# Altium schematic sheet PWR_MGMT.SchDoc
size A4; SheetNumber: 4; SheetTotal: 5
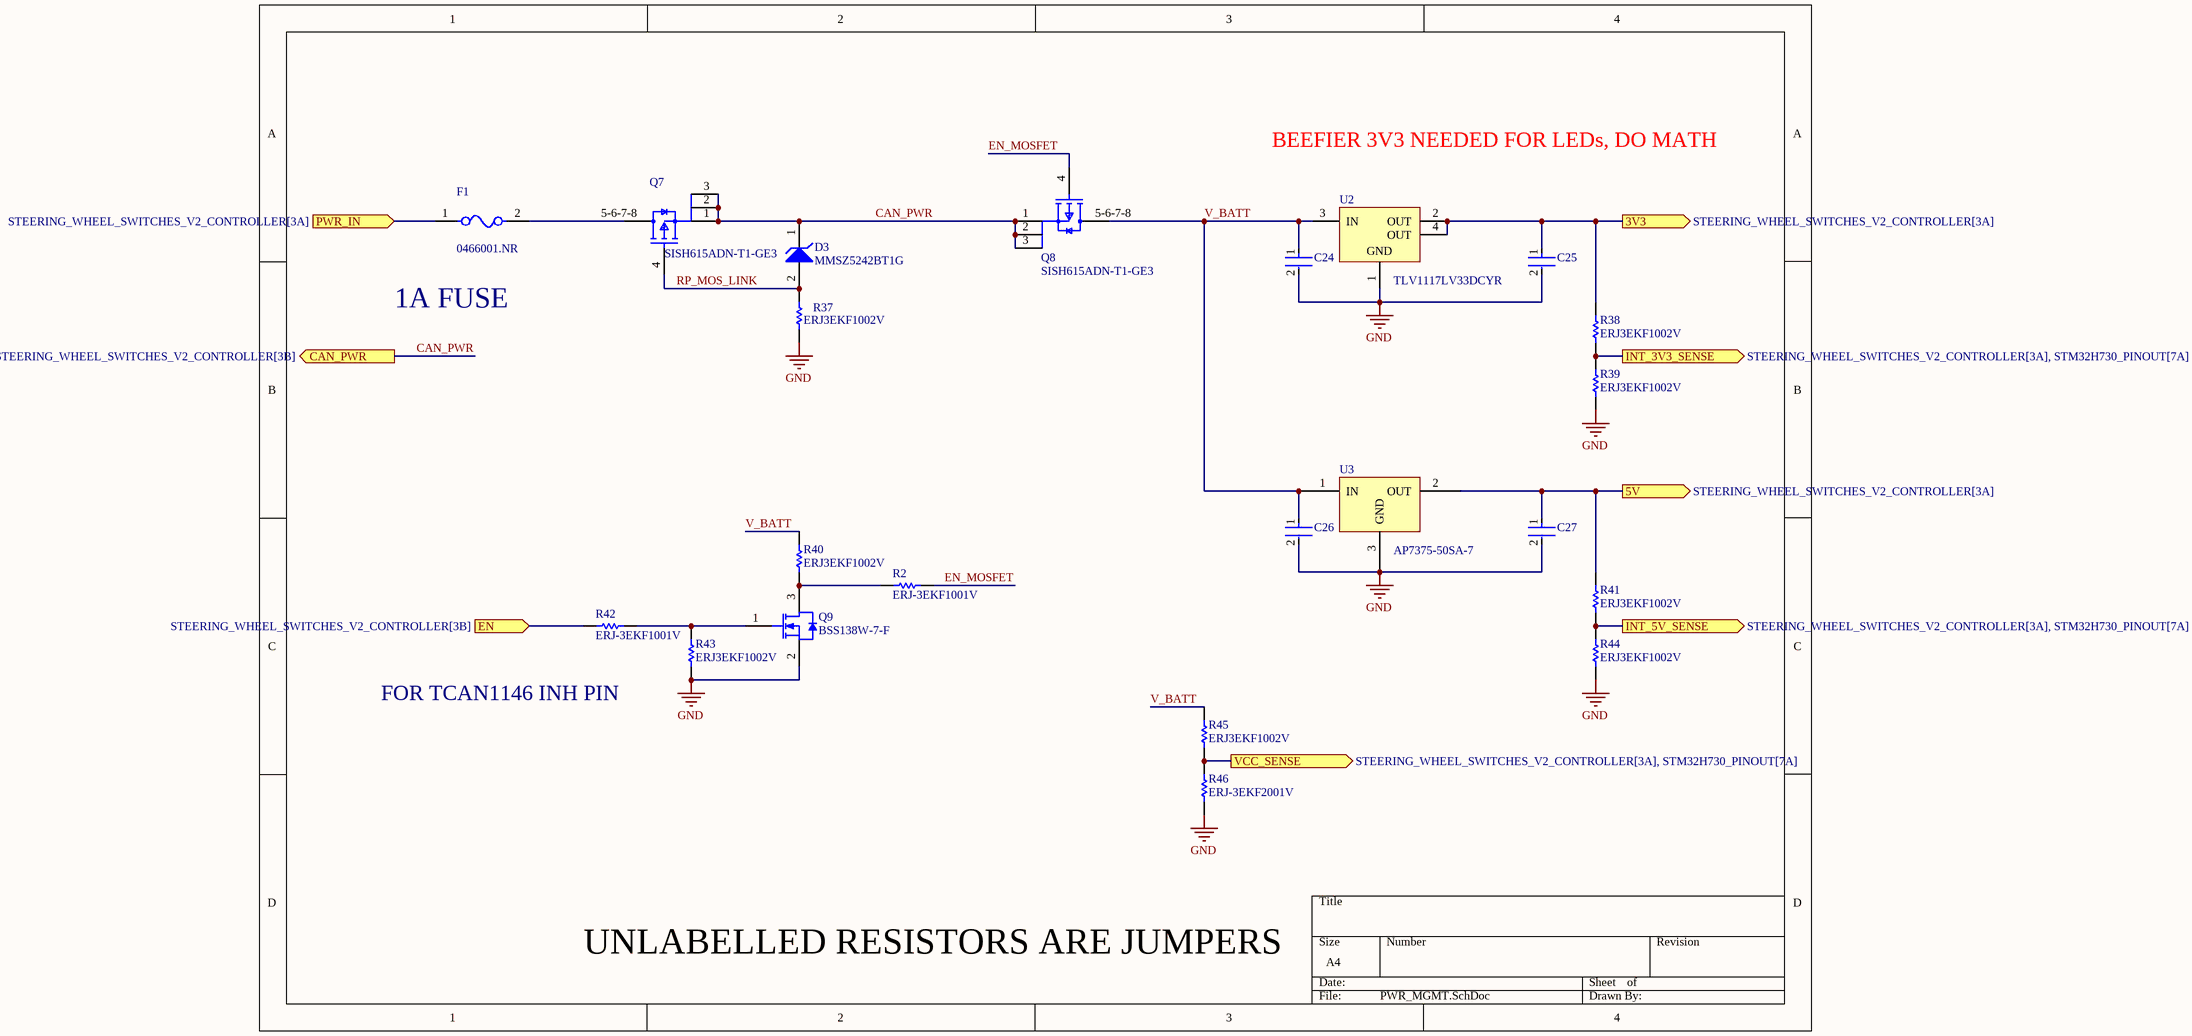
[diagram p0: PWR_MGMT.SchDoc]

## Parts
C24  GRM188R61E106KA73D  [FP-GRM188-0_2-IPC_A]  (value not drawn)
C25  GRM188R61E106KA73D  [FP-GRM188-0_2-IPC_A]  (value not drawn)
C26  GRM188R61E106KA73D  [FP-GRM188-0_2-IPC_A]  (value not drawn)
C27  GRM188R61E106KA73D  [FP-GRM188-0_2-IPC_A]  (value not drawn)
D3  MMSZ5242BT1G  [ONSC-SOD-123-2-425-04_V]
F1  0466001.NR  [FP-0466-MFG]
Q7  SISH615ADN-T1-GE3  [SISH615ADN-T1-GE3-Footprint-1]
Q8  SISH615ADN-T1-GE3  [SISH615ADN-T1-GE3-Footprint-1]
Q9  BSS138W-7-F  [DIOD-SOT323-3_V]
R2  ERJ-3EKF1001V  [RESC1608X55X30LL15T15]
R37  ERJ3EKF1002V  [RESC1609X55X30LL15T15]
R38  ERJ3EKF1002V  [RESC1609X55X30LL15T15]
R39  ERJ3EKF1002V  [RESC1609X55X30LL15T15]
R40  ERJ3EKF1002V  [RESC1609X55X30LL15T15]
R41  ERJ3EKF1002V  [RESC1609X55X30LL15T15]
R42  ERJ-3EKF1001V  [RESC1608X55X30LL15T15]
R43  ERJ3EKF1002V  [RESC1609X55X30LL15T15]
R44  ERJ3EKF1002V  [RESC1609X55X30LL15T15]
R45  ERJ3EKF1002V  [RESC1609X55X30LL15T15]
R46  ERJ-3EKF2001V  [RESC1608X55X30ML15T15]
U2  TLV1117LV33DCYR  [DCY0004A_N]
U3  AP7375-50SA-7  [AP7375-50SA-7-Footprint-1]

## Ports
3V3 (out, see STEERING_WHEEL_SWITCHES_V2_CONTROLLER[3A]), 5V (out, see STEERING_WHEEL_SWITCHES_V2_CONTROLLER[3A]), CAN_PWR (out, see STEERING_WHEEL_SWITCHES_V2_CONTROLLER[3B]), EN (in, see STEERING_WHEEL_SWITCHES_V2_CONTROLLER[3B]), INT_3V3_SENSE (out, see STEERING_WHEEL_SWITCHES_V2_CONTROLLER[3A], STM32H730_PINOUT[7A]), INT_5V_SENSE (out, see STEERING_WHEEL_SWITCHES_V2_CONTROLLER[3A], STM32H730_PINOUT[7A]), PWR_IN (in, see STEERING_WHEEL_SWITCHES_V2_CONTROLLER[3A]), VCC_SENSE (out, see STEERING_WHEEL_SWITCHES_V2_CONTROLLER[3A], STM32H730_PINOUT[7A])

## Nets
GND: C24.2 C25.2 C26.2 C27.2 Q9.2(S) R37.2 R39.1 R43.1 R44.2 R46.1 U2.1(GND) U3.3(GND)
3V3: C25.1 R38.2 U2.2(OUT) U2.4(OUT) ; port 3V3
5V: C27.1 R41.2 U3.2(OUT) ; port 5V
CAN_PWR: D3.1(K) Q7.1(S) Q7.2(S) Q7.3(S) Q8.1(S) Q8.2(S) Q8.3(S) ; port CAN_PWR
EN: R42.2 ; port EN
EN_MOSFET: Q8.4(G) R2.1
INT_3V3_SENSE: R38.1 R39.2 ; port INT_3V3_SENSE
INT_5V_SENSE: R41.1 R44.1 ; port INT_5V_SENSE
PWR_IN: F1.1 ; port PWR_IN
RP_MOS_LINK: D3.2(A) Q7.4(G) R37.1
V_BATT: C24.1 C26.1 Q8.5-6-7-8(D) R40.2 R45.2 U2.3(IN) U3.1(IN)
VCC_SENSE: R45.1 R46.2 ; port VCC_SENSE
NetF1_2: F1.2 Q7.5-6-7-8(D)
NetQ9_1: Q9.1(G) R42.1 R43.2
NetQ9_3: Q9.3(D) R2.2 R40.1

## Notes on the sheet
- BEEFIER 3V3 NEEDED FOR LEDs, DO MATH
- 1A FUSE
- FOR TCAN1146 INH PIN
- UNLABELLED RESISTORS ARE JUMPERS

## Library data of the parts
C24-C27 = CMP-06035-045268-1: Chip Multilayer Ceramic Capacitors for General Purpose, 0603, 10uF, X5R, 15%, 10%, 25V; Case/Package: 0603
D3 = CMP-1060-00565-1: Zener Voltage Regulator, 500 mW, 2-Pin SOD-123, Pb-Free, Tape and Reel; Manufacturer: On Semiconductor; P Max (W): 0.5; VZ Typ (V): 12; PartNumber: MMSZ5242BT1G; PackageReference: SOD-123-2-425-04; ComponentLink3URL: http://www.onsemi.com/pub_link/Collateral/425-04.PDF; Mounting Technology: Surface Mount; ComponentLink2Description: Datasheet; ComponentLink1URL: http://www.onsemi.com/; ComponentLink3Description: Package Specification; PackageDescription: 2-Pin SOD, Body 1.6 x 2.69 mm; PackageVersion: Rev. G, 10/2009; ComponentLink1Description: Manufacturer URL; RoHS: Pb-Free; ComponentLink2URL: http://www.onsemi.com/pub_link/Collateral/MMSZ5221BT1-D.PDF; Packing: Tape and Reel; DatasheetVersion: Rev. 12
F1 = CMP-08605-000058-1: FUSE BOARD MNT 1A 63VAC/VDC 1206; Manufacturer: Littelfuse Inc; Max Fuse Dc Voltage: 63V; Fuse Interrupt Ac Current: 50A; Fuse Voltage Drop: 79.97mV; Resistance: 0.075Ω; Value: 0.075Ω; Fuse I2T: 0.0423A2Sec; Fuse Blow Speed: Fast; Temperature Range High: +90°C; Max Fuse Ac Voltage: 63V; Manufacturer Part Number: 0466001.NR; Package: 0466; ComponentLink2URL: https://www.littelfuse.com/~/media/electronics/datasheets/fuses/littelfuse_fuse_466_datasheet.pdf.pdf; Device Class L3: unset; Lead Free: Yes; Automotive: No; Digikey Description: FUSE BOARD MNT 1A 63VAC/VDC 1206; Height: 0.66mm; Temperature Range Low: -55°C; Category: Fuse; ComponentLink2Description: Datasheet; Device Class L1: Circuit Protection; Device Class L2: Fuses; Fuse Current: 1A; Mouser Description: Surface Mount Fuses 63V FA 1206 1A VFA Slimline; Octopart: https://octopart.com/0466001.nr-littelfuse-566005; Fuse Interrupt Dc Current: 50A; RoHS: TRUE; Voltage Rating: 63V; Temperature: -55°C to +90°C
Q7 Q8 = CMP-013-00018-2: Trans MOSFET P-CH 20V 22.1A 8-Pin PowerPAK 1212 EP T/R; Source: SISH615ADN-T1-GE3.SchLib; Design Item ID: CMP-013-00036-4; Component Type: Standard; Pins: 5
Q9 = CMP-2000-05968-1: N-Channel Enhancement Mode Mosfet, 50 V, 200 mA, -55 to 150 degC, 6-Pin SOT-323, RoHS, Tape and Reel; Typical Turn-Off Delay Time: 20ns; Number of Channels: 1Channel; Type: EnhancementModeFieldEffectTransistor; Brand: DiodesIncorporated; Vds - Drain-Source Breakdown Voltage: 75V; Vgs - Gate-Source Voltage: 20V; Rds On - Drain-Source Resistance: 1.4Ohms; Transistor Type: 1N-Channel; Configuration: Single; Unit Weight: 0.000212oz; Pd - Power Dissipation: 200mW; Id - Continuous Drain Current: 200mA; Forward Transconductance - Min: 0.1S; Manufacturer URL: http://www.diodes.com/; Series: BSS138; Package Description: 3-Pin Small Outline Transistor, Body 2 x 1.25 mm, Pitch 0.65 mm; Mounting Technology: SurfaceMount; Product Category: MOSFET; RoHS: True; Maximum Operating Temperature: +150C; Height: 1mm; Length: 2.2mm; Technology: Si; Width: 1.35mm; Datasheet URL: http://www.diodes.com/_files/datasheets/ds30206.pdf; Manufacturer: DiodesIncorporated; Package / Case: SOT-323-3; Typical Turn-On Delay Time: 20ns; Transistor Polarity: N-Channel; Factory Pack Quantity: 3000; Packaging: Reel; Product: MOSFETSmallSignal; Datasheet Version: Rev. 11-2, 09/2013; Package Reference: SOT323; Minimum Operating Temperature: -55C; Mounting Style: SMD/SMT; Channel Mode: Enhancement
R2 R42 = CMP-2000-00180-1: Manufacturer: Panasonic; Part Number: ERJ-3EKF1001V
R37-R41 R43-R45 = CMP-1012-00623-3: Chip Resistor, 10 KOhm, +/- 1%, 0.1 W, -55 to 155 degC, 0603 (1608 Metric), RoHS, Tape and Reel; Manufacturer: Panasonic; Voltage Rating: 75V; Case\/Package: 0603; Power Rating: 100mW; Resistance: 10KOhm; Temperature Coefficient: 100ppm\/degreesC; Number of Pins: 2; Package Reference: 603; Depth: 0.8mm; Mount: SurfaceMount; Package Description: 2-Pin Surface Mount Device, Body 1.6 x 0.85 mm; Datasheet Version: 02/2017; Length: 1.6mm; Lead Free: LeadFree; Height: 0.45mm; Number of Terminations: 2; Max Power Dissipation: 100mW; Min Operating Temperature: -55degC; Datasheet URL: https://industrial.panasonic.com/cdbs/www-data/pdf/RDA0000/AOA0000C304.pdf; Termination: SMD/SMT; Case Code (Metric): 1608; Case Code (Imperial): 0603; Tolerance: 1%; Max Operating Temperature: 155degC; RoHSCompliant: true; Voltage Rating (DC): 75V; Radiation Hardening: No; Packaging: TapeandReel; Composition: ThickFilm; Mounting Technology: SurfaceMount; Manufacturer URL: http://www.panasonic.com/; Width: 0.031inch; REACH SVHC: NoSVHC; Contact Plating: Tin; Military Standard: Not; Package Quantity: 1
R46 = CMP-2000-00317-1: Manufacturer: Panasonic; Part Number: ERJ-3EKF2001V
U2 = CMP-0395-00503-2: Single Output LDO, 1 A, Fixed 3.3 V Output, 2 to 5.5 V Input, 4-pin SOT-223 (DCY), -40 to 125 degC, Green (RoHS & no Sb/Br); Manufacturer: Texas Instruments; Vout Adj(Min)(V): 3.3; Vdo(Typ)(mV): 1200; Iq(Typ)(mA): 0.05; Accuracy(%): 2; Iout(Max)(A): 1; SubFamily: Single Channel LDO; Vin(Max)(V): 5.5; PackageReference: DCY0004A; PackageDescription: 4-Pin Plastic Small Outline, Body 3.5 x 6.5 mm, Pitch 2.3 mm; Vout Adj(Max)(V): 3.3; Mounting Technology: Surface Mount; ComponentLink2Description: Datasheet; ComponentLink1Description: Manufacturer URL; PartNumber: TLV1117LV33DCYR; ComponentLink3Description: Package Specification; ComponentLink1URL: http://www.ti.com/; ComponentLink2URL: http://www.ti.com/general/docs/lit/getliterature.tsp?genericPartNumber=TLV1117LV33&fileType=pdf; Fixed Output Options(V): 3.3; PackageVersion: 4202506/B; Vin(Min)(V): 2; DatasheetVersion: SBVS160A; Eco-Plan: Green (RoHS & no Sb/Br); ComponentLink3URL: http://www.ti.com/litv/pdf/mpds094a; Code_JEDEC: TO-261
U3 = CMP-019-00041-1: Ldo Cmos Lowcurr SOT23 T&r 3K